# Altium schematic sheet Microcontroller.SchDoc
size A4
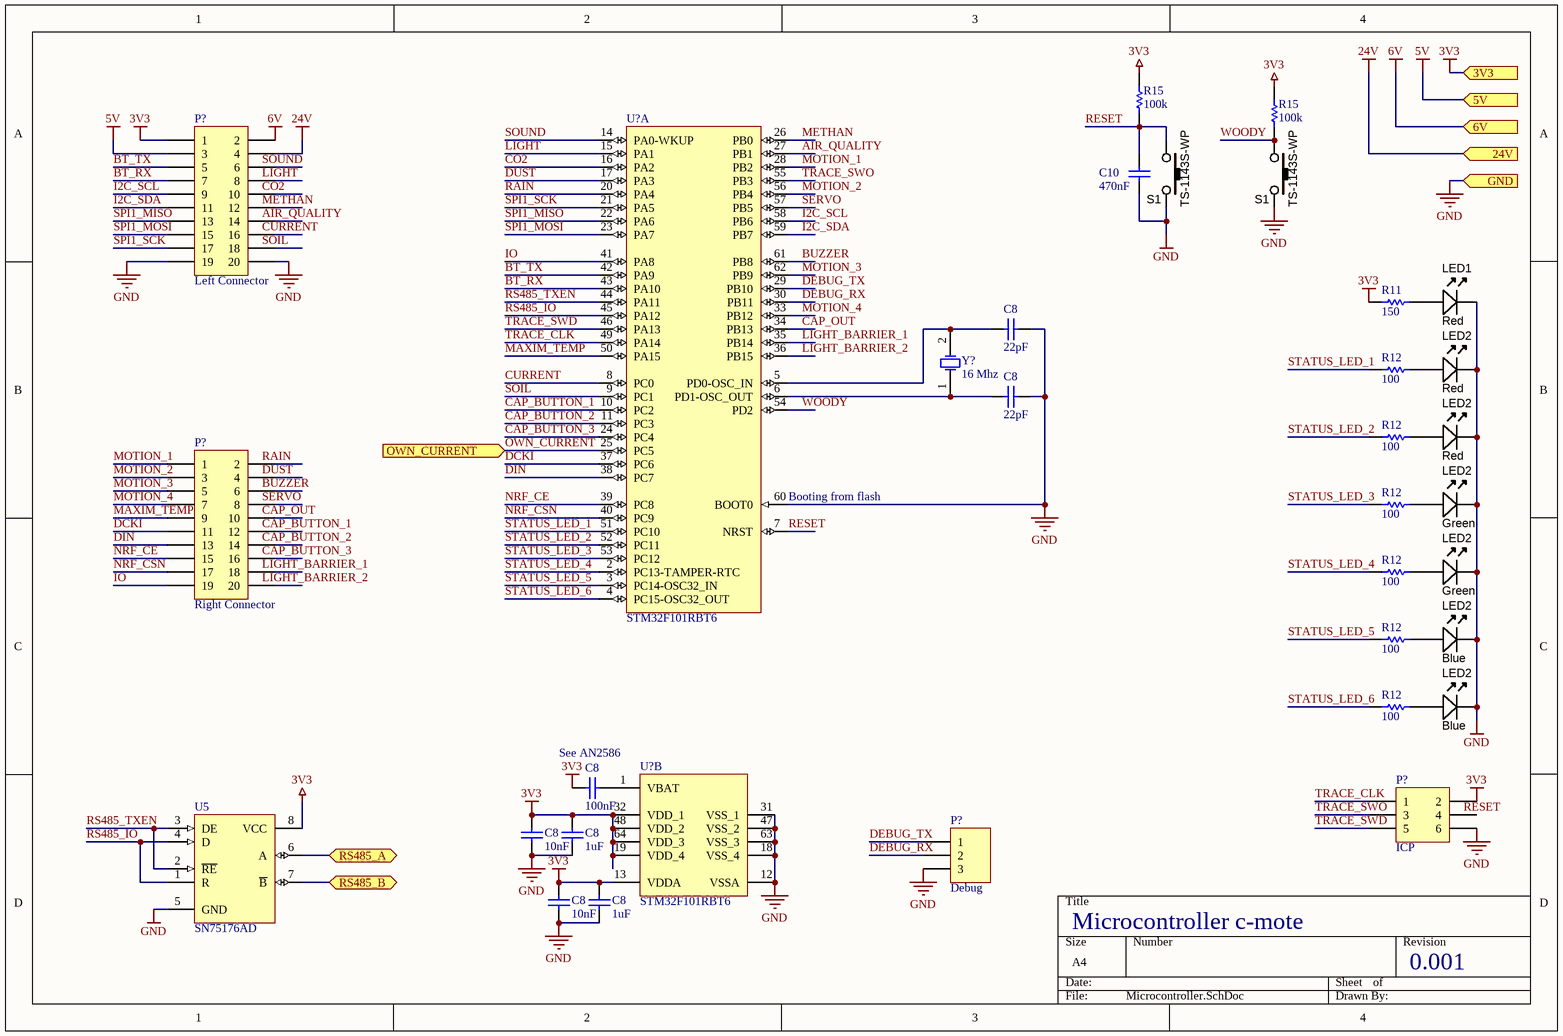
[diagram p0: Microcontroller.SchDoc]

## Parts
(Parts that share a designator on the sheet are numbered #1, #2 ... from top to bottom, then left to right.)
C8#1  value 22pF  [CAPC0805(2012)100_M]  (hidden comment: CAP 22pF 10V 0805(2012))
C8#2  value 22pF  [CAPC0805(2012)100_M]  (hidden comment: CAP 22pF 10V 0805(2012))
C8#3  value 100nF  [CAPC0805(2012)100_M]  (hidden comment: CAP 22pF 10V 0805(2012))
C8#4  value 10nF  [CAPC0805(2012)100_M]  (hidden comment: CAP 22pF 10V 0805(2012))
C8#5  value 1uF  [CAPC0805(2012)100_M]  (hidden comment: CAP 22pF 10V 0805(2012))
C8#6  value 10nF  [CAPC0805(2012)100_M]  (hidden comment: CAP 22pF 10V 0805(2012))
C8#7  value 1uF  [CAPC0805(2012)100_M]  (hidden comment: CAP 22pF 10V 0805(2012))
C10  value 470nF  [CAPC0805(2012)145_M]  (hidden comment: CAP 470nF 10V 0805(2012))
LED1  Color: Red  [LED-0805-K]
LED2#1  Color: Red  [LED-0805-K]
LED2#2  Color: Red  [LED-0805-K]
LED2#3  Color: Green  [LED-0805-K]
LED2#4  Color: Green  [LED-0805-K]
LED2#5  Color: Blue  [LED-0805-K]
LED2#6  Color: Blue  [LED-0805-K]
P?#1  Left Connector  [HDR2X10]
P?#2  Right Connector  [HDR2X10]
P?#3  ICP  [HDR2X3]
P?#4  Debug  [HDR1X3]
R11  150  [6-0805]
R12#1  100  [6-0805]
R12#2  100  [6-0805]
R12#3  100  [6-0805]
R12#4  100  [6-0805]
R12#5  100  [6-0805]
R12#6  100  [6-0805]
R15#1  100k  [6-0805]
R15#2  100k  [6-0805]
S1#1  TS-1143S-WP  [TS-1143S]
S1#2  TS-1143S-WP  [TS-1143S]
U5  SN75176AD  [SOIC127P600X175-8AN]
U?#1  STM32F101RBT6  [STM-LQFP64_N]  (part A of 2)
U?#2  STM32F101RBT6  [STM-LQFP64_N]  (part B of 2)
Y?  16 Mhz  [R38]

## Ports
3V3 (in), 5V (in), 6V (in), 24V (in), GND (in), OWN_CURRENT (in), RS485_A (bidir), RS485_B (bidir)

## Nets
3V3: C8#3.2 C8#4.2 C8#5.2 C8#6.2 C8#7.2 P?#1.1 P?#3.2 R11.2 R15#1.2 R15#2.2 U5.8(VCC) U?#2.13(VDDA) U?#2.19(VDD_4) U?#2.32(VDD_1) U?#2.48(VDD_2) U?#2.64(VDD_3) ; port 3V3
5V: P?#1.3 ; port 5V
6V: P?#1.2 ; port 6V
24V: P?#1.4 ; port 24V
GND: C8#1.1 C8#2.1 C8#4.1 C8#5.1 C8#6.1 C8#7.1 C10.1 LED1.K LED2#1.K LED2#2.K LED2#3.K LED2#4.K LED2#5.K LED2#6.K P?#1.19 P?#1.20 P?#3.6 P?#4.3 S1#1.2 S1#2.2 U5.5(GND) U?#1.60(BOOT0) U?#2.12(VSSA) U?#2.18(VSS_4) U?#2.31(VSS_1) U?#2.47(VSS_2) U?#2.63(VSS_3) ; port GND
AIR_QUALITY: U?#1.27(PB1)
BT_RX: P?#1.7 U?#1.43(PA10)
BT_TX: P?#1.5 U?#1.42(PA9)
BUZZER: U?#1.61(PB8)
CAP_BUTTON_1: U?#1.10(PC2)
CAP_BUTTON_2: U?#1.11(PC3)
CAP_BUTTON_3: U?#1.24(PC4)
CAP_OUT: U?#1.34(PB13)
CO2: U?#1.16(PA2)
CURRENT: U?#1.8(PC0)
DCKI: P?#2.11 U?#1.37(PC6)
DEBUG_RX: P?#4.2 U?#1.30(PB11)
DEBUG_TX: P?#4.1 U?#1.29(PB10)
DIN: P?#2.13 U?#1.38(PC7)
DUST: U?#1.17(PA3)
I2C_SCL: P?#1.9 U?#1.58(PB6)
I2C_SDA: P?#1.11 U?#1.59(PB7)
IO: P?#2.19 U?#1.41(PA8)
LIGHT: U?#1.15(PA1)
LIGHT_BARRIER_1: U?#1.35(PB14)
LIGHT_BARRIER_2: U?#1.36(PB15)
MAXIM_TEMP: P?#2.9 U?#1.50(PA15)
METHAN: U?#1.26(PB0)
MOTION_1: P?#2.1 U?#1.28(PB2)
MOTION_2: P?#2.3 U?#1.56(PB4)
MOTION_3: P?#2.5 U?#1.62(PB9)
MOTION_4: P?#2.7 U?#1.33(PB12)
NRF_CE: P?#2.15 U?#1.39(PC8)
NRF_CSN: P?#2.17 U?#1.40(PC9)
OWN_CURRENT: U?#1.25(PC5) ; port OWN_CURRENT
RAIN: U?#1.20(PA4)
RESET: C10.2 R15#1.1 S1#1.1 U?#1.7(NRST)
RS485_A: U5.6(A) ; port RS485_A
RS485_B: U5.7(~{B}) ; port RS485_B
RS485_IO: U5.1(R) U5.4(D) U?#1.45(PA12)
RS485_TXEN: U5.2(~{RE}) U5.3(DE) U?#1.44(PA11)
SERVO: U?#1.57(PB5)
SOIL: U?#1.9(PC1)
SOUND: U?#1.14(PA0-WKUP)
SPI1_MISO: P?#1.13 U?#1.22(PA6)
SPI1_MOSI: P?#1.15 U?#1.23(PA7)
SPI1_SCK: P?#1.17 U?#1.21(PA5)
STATUS_LED_1: R12#1.2 U?#1.51(PC10)
STATUS_LED_2: R12#2.2 U?#1.52(PC11)
STATUS_LED_3: R12#3.2 U?#1.53(PC12)
STATUS_LED_4: R12#4.2 U?#1.2(PC13-TAMPER-RTC)
STATUS_LED_5: R12#5.2 U?#1.3(PC14-OSC32_IN)
STATUS_LED_6: R12#6.2 U?#1.4(PC15-OSC32_OUT)
TRACE_CLK: P?#3.1 U?#1.49(PA14)
TRACE_SWD: P?#3.5 U?#1.46(PA13)
TRACE_SWO: P?#3.3 U?#1.55(PB3)
WOODY: R15#2.1 S1#2.1 U?#1.54(PD2)
NetC8#1_2: C8#1.2 U?#1.5(PD0-OSC_IN) Y?.2(OSC2)
NetC8#2_2: C8#2.2 U?#1.6(PD1-OSC_OUT) Y?.1(OSC1)
NetC8#3_1: C8#3.1 U?#2.1(VBAT)
NetLED1_A: LED1.A R11.1
NetLED2#1_A: LED2#1.A R12#1.1
NetLED2#2_A: LED2#2.A R12#2.1
NetLED2#3_A: LED2#3.A R12#3.1
NetLED2#4_A: LED2#4.A R12#4.1
NetLED2#5_A: LED2#5.A R12#5.1
NetLED2#6_A: LED2#6.A R12#6.1

Not connected (* = marked no-connect by the designer): P?#1 6 8 10 12 14 16 18; P?#2 2 4 6 8 10 12 14 16 18 20; P?#3 4

## Notes on the sheet
- (near U?#1) Booting from flash
- See AN2586
- Microcontroller c-mote
- 0.001
- Labels drawn without touching a wire or pin: AIR_QUALITY, BUZZER, CAP_BUTTON_1, CAP_BUTTON_2, CAP_BUTTON_3, CAP_OUT, CO2, CURRENT, DUST, LIGHT, LIGHT_BARRIER_1, LIGHT_BARRIER_2, METHAN, RAIN, RESET, SERVO, SOIL, SOUND

## Library data of the parts
C8#1-C8#7 = CMP-1036-01210-1: CAP 22pF 10V ±5% 0805 (2012 Metric) Thickness 1mm SMD; Case-EIA: 0805; Case-Metric: 2012; Max Thickness: 1 mm; Rated Voltage: 10 V; Tolerance: ±5%; Technology: SMT
C10 = CMP-1036-04631-1: CAP 470nF 10V ±10% 0805 (2012 Metric) Thickness 1.45mm SMD; Case-EIA: 0805; Case-Metric: 2012; Max Thickness: 1.45 mm; Rated Voltage: 10 V; Technology: SMT; Tolerance: ±10%
LED1 = LED_SMD_Red_0805_6mcd: LED 0805 SMD Red 6mcd 621nm; Manufacturer 1: Lite-On Inc; Manufacturer Part Number 1: LTST-C171EKT; Material: GaAsP on GaP; Ratings: 6 mcd; 621 nm; SCDType: source; Package / Case: 0805; Supplier 1: Digi-Key; Supplier Part Number 1: 160-1422-1-ND; Value: Red
LED2#1 LED2#2 = LED_SMD_Green_0805_6mcd: LED, 0805 SMD, Green; Manufacturer 1: LITE-ON; Manufacturer Part Number 1: LTST-C171GKT; Material: GaP; Ratings: 6 mcd; 569 nm; Value: Red; SCDType: source; Package / Case: 0805; Supplier 1: Digi-Key; Supplier Part Number 1: 160-1423-1-ND
LED2#3 LED2#4 = LED_SMD_Green_0805_6mcd: LED, 0805 SMD, Green; Manufacturer 1: LITE-ON; Manufacturer Part Number 1: LTST-C171GKT; Material: GaP; Ratings: 6 mcd; 569 nm; SCDType: source; Package / Case: 0805; Supplier 1: Digi-Key; Supplier Part Number 1: 160-1423-1-ND; Value: Green
LED2#5 LED2#6 = LED_SMD_Green_0805_6mcd: LED, 0805 SMD, Green; Manufacturer 1: LITE-ON; Manufacturer Part Number 1: LTST-C171GKT; Material: GaP; Ratings: 6 mcd; 569 nm; Value: Blue; SCDType: source; Package / Case: 0805; Supplier 1: Digi-Key; Supplier Part Number 1: 160-1423-1-ND
P?#1 P?#2 = Header 10X2: Header, 10-Pin, Dual row; LatestRevisionDate: 17-Jul-2002; LatestRevisionNote: Re-released for DXP Platform.; Publisher: Altium Limited
P?#3 = Header 3X2: Header, 3-Pin, Dual row; LatestRevisionDate: 17-Jul-2002; LatestRevisionNote: Re-released for DXP Platform.; Publisher: Altium Limited
P?#4 = Header 3: Header, 3-Pin; LatestRevisionDate: 17-Jul-2002; LatestRevisionNote: Re-released for DXP Platform.; Publisher: Altium Limited
R11 R12#1-R12#6 R15#1 R15#2 = ERJ6RB: Precision Thick Film Chip Resistor, 10 Ohm to 1M Ohm Range, 1% and 0.5% Tolerance, 0805 Size, 0.1 W; Published: 17-Dec-2003; LatestRevisionDate: 19-Mar-2004; LatestRevisionNote: Silkscreen size reduced.; PackageDocument: Mar-2003; PackageReference: 6-0805; Publisher: Altium Limited; Code_IPC: 2012 [0805]; ComponentLink1Description: Manufacturer Link; ComponentLink1URL: http://www.panasonic.com/industrial/components/resistive_products.htm; ComponentLink2Description: Datasheet; ComponentLink2URL: http://www.panasonic.com/industrial/components/pdf/AOA0000CE2.pdf
S1#1 S1#2 = SW_SMD_PB_4.3mm: Switch SMD Tact 4.3mm Stem; Manufacturer 1: Bond-Tact; Manufacturer Part Number 1: TS-1143S-WP-200; SCDType: spec; Package / Case: 6.5x6.5mm; 4.3mm stem
U5 = SN75176AD: Differential Bus Transceiver; Note: Receiver Hysteresis of 50mV Typical; Published: 15-May-2002; LatestRevisionDate: 13-Apr-2006; LatestRevisionNote: IPC-7351 Footprint Added.; DatasheetVersion: Aug-1989; PackageVersion: Jan-1998; PackageReference: D008; Publisher: Altium Limited; PackageDescription: 8-Pin Small Outline Integrated Circuit 1.27 mm Pitch; Code_IPC: SOIC127P600-8; ComponentLink1Description: Manufacturer Link; ComponentLink1URL: http://www.ti.com/; ComponentLink2Description: Datasheet; ComponentLink2URL: http://www-s.ti.com/sc/ds/sn75176a.pdf
U?#1 U?#2 = CMP-0237-00131-3: ARM Cortex-M3 32-bit MCU, 128 KB Flash, 16 KB Internal RAM, 51 I/Os, 64-pin LQFP, -40 to 85 degC, Tray; I/Os (High Current): 51; Supply Voltage(Vcc) min (V): 2; Operating Frequency(F) (Processor speed) (MHz): 36; FLASH Size (Prog) (kB): 128; Internal RAM Size (kB): 16; A/D Converter: 1x12-bit (16 Channel); ComponentLink3Description: Package Specification; ComponentLink1Description: Manufacturer URL; PackageVersion: Rev. 4, 06/2013; Mounting Technology: Surface Mount; Core: ARM Cortex-M3; DatasheetVersion: Rev. 16; ComponentLink2Description: Datasheet; ComponentLink2URL: http://www.st.com/st-web-ui/static/active/en/resource/technical/document/datasheet/CD00161561.pdf; PackageDescription: 64-Pin Low Profile Quad Flat Package, 10 x 10 mm Body, 0.5 mm Pitch; ComponentLink1URL: http://www.st.com/web/en/home.html; ComponentLink3URL: http://www.st.com/st-web-ui/static/active/en/resource/technical/document/datasheet/DM00037051.pdf; PackageReference: LQFP64; Packing: Tray; PartNumber: STM32F101RBT6
Y? = XTAL: Crystal Oscillator; Published: 8-Jun-2000; LatestRevisionDate: 17-Jul-2002; LatestRevisionNote: Re-released for DXP Platform.; PackageReference: R38; Publisher: Altium Limited; PackageDescription: Crystal, Thru-Hole; 2 Leads; Body 3.1 x 8.2 mm (Dia.xH); Frequency: 16 Mhz